# Altium schematic sheet HBridge.SchDoc: Sample Sheet Title
size B; Date: MM/DD/YYYY; Author: Sample Author; Organization: ORGANIZATION; Address1: ADDRESS 1; Address2: ADDRESS 2; Address3: ADDRESS 3; Address4: ADDRESS 4; Revision: -; SheetNumber: 1; SheetTotal: 3; ENG_APP_DATE: --/--/--; DSN_APP_DATE: --/--/--; CHK_APP_DATE: --/--/--
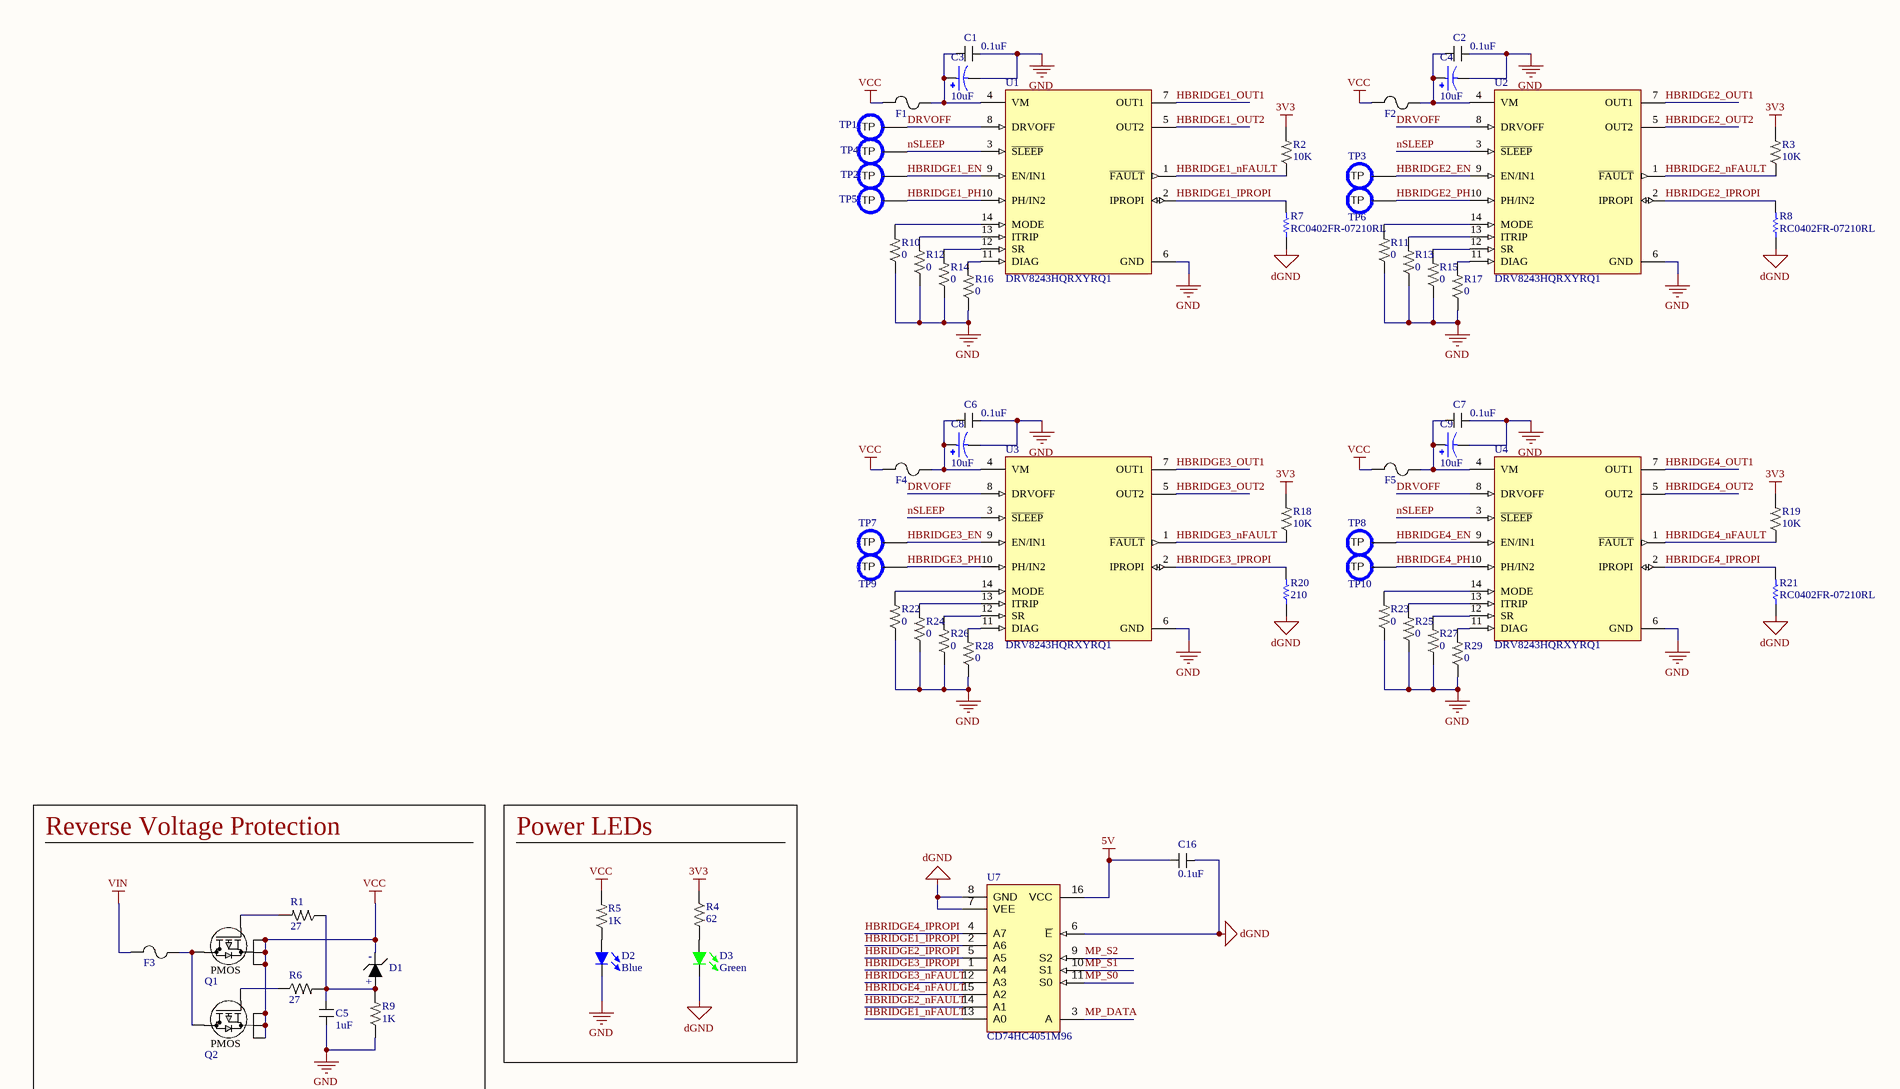
[diagram p0: HBridge.SchDoc, top left]
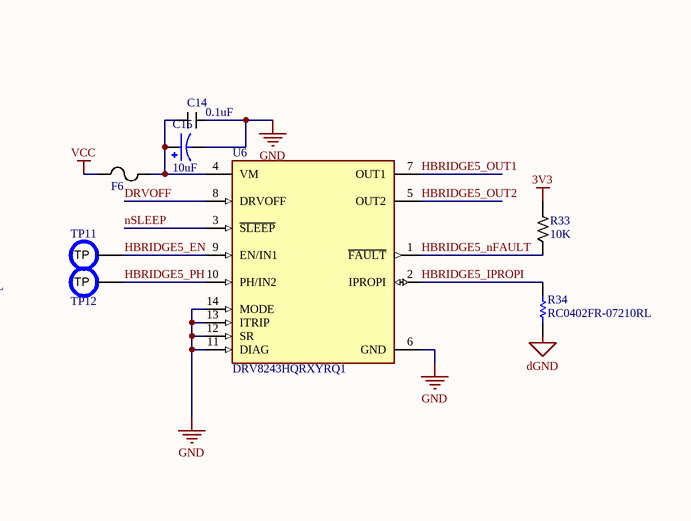
[diagram p1: HBridge.SchDoc, top right]
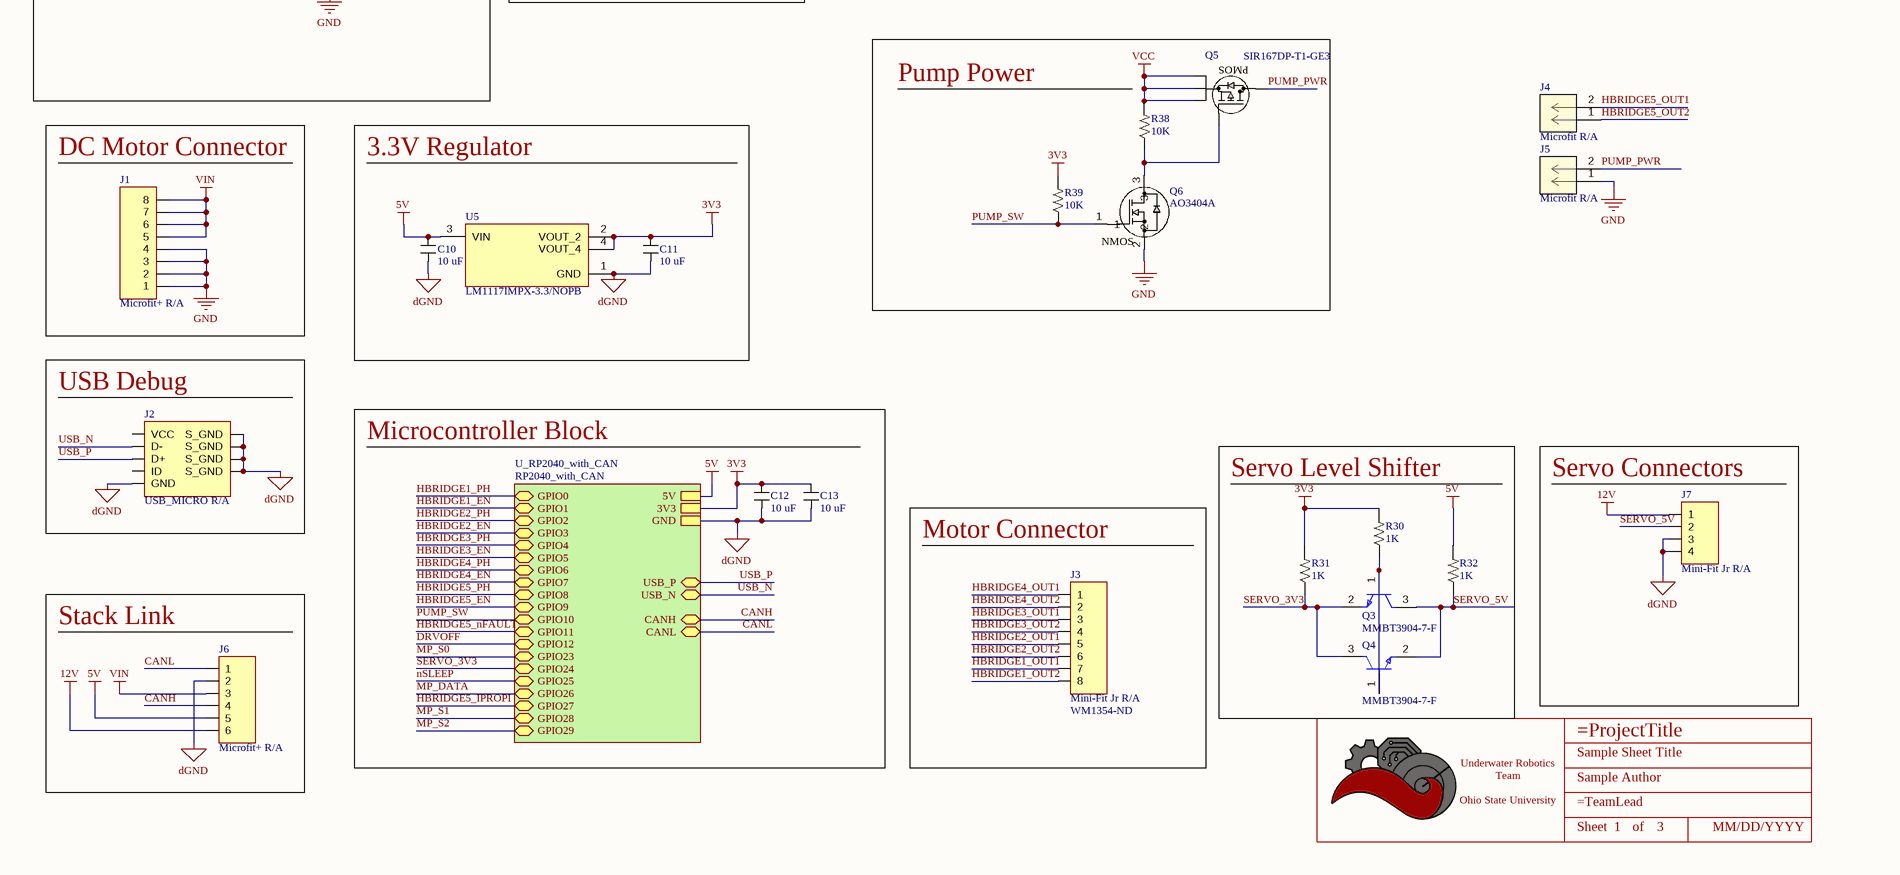
[diagram p2: HBridge.SchDoc, bottom left]

## Parts
*  Title_Block  [LOGO]  (value not drawn)  (graphical)
C1  value 0.1uF  [CAPACITOR_0805]  (hidden comment: 100nF Ceramic 50V)
C2  value 0.1uF  [CAPACITOR_0805]  (hidden comment: 100nF Ceramic 50V)
C3  value 10uF  [CAP_EEHZC1J100P]  (hidden comment: 10uF electrolytic 63V)
C4  value 10uF  [CAP_EEHZC1J100P]  (hidden comment: 10uF electrolytic 63V)
C5  value 1uF  [CAPACITOR_0603]  (hidden comment: 1uF Ceramic 16V)
C6  value 0.1uF  [CAPACITOR_0805]  (hidden comment: 100nF Ceramic 50V)
C7  value 0.1uF  [CAPACITOR_0805]  (hidden comment: 100nF Ceramic 50V)
C8  value 10uF  [CAP_EEHZC1J100P]  (hidden comment: 10uF electrolytic 63V)
C9  value 10uF  [CAP_EEHZC1J100P]  (hidden comment: 10uF electrolytic 63V)
C10  Value (uF): 10 uF  [CAPACITOR_0603]  (hidden comment: 10uF Ceramic 6.3V)
C11  Value (uF): 10 uF  [CAPACITOR_0603]  (hidden comment: 10uF Ceramic 6.3V)
C12  Value (uF): 10 uF  [CAPACITOR_0603]  (hidden comment: 10uF Ceramic 6.3V)
C13  Value (uF): 10 uF  [CAPACITOR_0603]  (hidden comment: 10uF Ceramic 6.3V)
C14  value 0.1uF  [CAPACITOR_0805]  (hidden comment: 100nF Ceramic 50V)
C15  value 10uF  [CAP_EEHZC1J100P]  (hidden comment: 10uF electrolytic 63V)
C16  value 0.1uF  [CAPACITOR_0402]  (hidden comment: 100nF Ceramic 25V)
D1  Zener_Diode_10V_410mW  [SOD-123]  (value not drawn)
D2  Color: Blue  [LED_0603]  (hidden comment: 150060BS75000)
D3  Color: Green  [LED_0603]  (hidden comment: 150060GS75000)
F1  0685H9150-01  [0501Series_LTF]  (value not drawn)
F2  0685H9150-01  [0501Series_LTF]  (value not drawn)
F3  1245HC60-RTR  [2-SMD Fuse]  (value not drawn)
F4  0685H9150-01  [0501Series_LTF]  (value not drawn)
F5  0685H9150-01  [0501Series_LTF]  (value not drawn)
F6  0685H9150-01  [0501Series_LTF]  (value not drawn)
J1  Microfit+ R/A  [CONN_MOLEX_MICROFIT+_8POS_R/A]
J2  USB_MICRO R/A  [CONN_MINIUSB]
J3  Mini-Fit Jr R/A  Supplier Part Number 1: WM1354-ND  [CONN_MOLEX_MINIFIT JR_8 POS_R/A]
J4  Microfit R/A  [CONN_MOLEX_MICROFIT_2 POS_R/A]
J5  Microfit R/A  [CONN_MOLEX_MICROFIT_2 POS_R/A]
J6  Microfit+ R/A  [CONN_MOLEX_MICROFIT_6_POS_R/A]
J7  Mini-Fit Jr R/A  [CONN_MOLEX_MINIFIT JR_4 POS_R/A]
Q1  MOSFET P-Ch 30V 60A SO-8  [MOSFET_7DP-T1-GE3_VIS]  (value not drawn)
Q2  MOSFET P-Ch 30V 60A SO-8  [MOSFET_7DP-T1-GE3_VIS]  (value not drawn)
Q3  MMBT3904-7-F  [FP-SOT23-IPC_A]
Q4  MMBT3904-7-F  [FP-SOT23-IPC_A]
Q5  SIR167DP-T1-GE3  [MOSFET_7DP-T1-GE3_VIS]
Q6  AO3404A  [SOT-23-3]
R1  Value  (Ohms): 27  [RESISTOR_0603]  (hidden comment: 27 Ohm 5% 1/8W)
R2  Value  (Ohms): 10K  [RESISTOR_0402]  (hidden comment: 10k Ohm 1% 1/16W)
R3  Value  (Ohms): 10K  [RESISTOR_0402]  (hidden comment: 10k Ohm 1% 1/16W)
R4  Value  (Ohms): 62  [RESISTOR_0603]  (hidden comment: 62 Ohm 1% 1/4W)
R5  Value  (Ohms): 1K  [RESISTOR_0603]  (hidden comment: 1k Ohm 5% 1/8W)
R6  Value  (Ohms): 27  [RESISTOR_0603]  (hidden comment: 27 Ohm 5% 1/8W)
R7  RC0402FR-07210RL  [RESC1005X40X25LL05T10]
R8  RC0402FR-07210RL  [RESC1005X40X25LL05T10]
R9  Value  (Ohms): 1K  [RESISTOR_0603]  (hidden comment: 1k Ohm 5% 1/8W)
R10  Value  (Ohms): 0  [RESISTOR_0402]  (hidden comment: 0 Ohm 1% 1/16W)
R11  Value  (Ohms): 0  [RESISTOR_0402]  (hidden comment: 0 Ohm 1% 1/16W)
R12  Value  (Ohms): 0  [RESISTOR_0402]  (hidden comment: 0 Ohm 1% 1/16W)
R13  Value  (Ohms): 0  [RESISTOR_0402]  (hidden comment: 0 Ohm 1% 1/16W)
R14  Value  (Ohms): 0  [RESISTOR_0402]  (hidden comment: 0 Ohm 1% 1/16W)
R15  Value  (Ohms): 0  [RESISTOR_0402]  (hidden comment: 0 Ohm 1% 1/16W)
R16  Value  (Ohms): 0  [RESISTOR_0402]  (hidden comment: 0 Ohm 1% 1/16W)
R17  Value  (Ohms): 0  [RESISTOR_0402]  (hidden comment: 0 Ohm 1% 1/16W)
R18  Value  (Ohms): 10K  [RESISTOR_0402]  (hidden comment: 10k Ohm 1% 1/16W)
R19  Value  (Ohms): 10K  [RESISTOR_0402]  (hidden comment: 10k Ohm 1% 1/16W)
R20  210  [RESC1005X40X25LL05T10]
R21  RC0402FR-07210RL  [RESC1005X40X25LL05T10]
R22  Value  (Ohms): 0  [RESISTOR_0402]  (hidden comment: 0 Ohm 1% 1/16W)
R23  Value  (Ohms): 0  [RESISTOR_0402]  (hidden comment: 0 Ohm 1% 1/16W)
R24  Value  (Ohms): 0  [RESISTOR_0402]  (hidden comment: 0 Ohm 1% 1/16W)
R25  Value  (Ohms): 0  [RESISTOR_0402]  (hidden comment: 0 Ohm 1% 1/16W)
R26  Value  (Ohms): 0  [RESISTOR_0402]  (hidden comment: 0 Ohm 1% 1/16W)
R27  Value  (Ohms): 0  [RESISTOR_0402]  (hidden comment: 0 Ohm 1% 1/16W)
R28  Value  (Ohms): 0  [RESISTOR_0402]  (hidden comment: 0 Ohm 1% 1/16W)
R29  Value  (Ohms): 0  [RESISTOR_0402]  (hidden comment: 0 Ohm 1% 1/16W)
R30  Value  (Ohms): 1K  [RESISTOR_0603]  (hidden comment: 1k Ohm 5% 1/8W)
R31  Value  (Ohms): 1K  [RESISTOR_0603]  (hidden comment: 1k Ohm 5% 1/8W)
R32  Value  (Ohms): 1K  [RESISTOR_0603]  (hidden comment: 1k Ohm 5% 1/8W)
R33  Value  (Ohms): 10K  [RESISTOR_0402]  (hidden comment: 10k Ohm 1% 1/16W)
R34  RC0402FR-07210RL  [RESC1005X40X25LL05T10]
R38  Value  (Ohms): 10K  [RESISTOR_0603]  (hidden comment: 10k Ohm 5% 1/10W)
R39  Value  (Ohms): 10K  [RESISTOR_0603]  (hidden comment: 10k Ohm 5% 1/10W)
TP1  PCB Test Point  [TESTPOINT_1.2MM]  (value not drawn)  (no BOM)
TP2  PCB Test Point  [TESTPOINT_1.2MM]  (value not drawn)  (no BOM)
TP3  PCB Test Point  [TESTPOINT_1.2MM]  (value not drawn)  (no BOM)
TP4  PCB Test Point  [TESTPOINT_1.2MM]  (value not drawn)  (no BOM)
TP5  PCB Test Point  [TESTPOINT_1.2MM]  (value not drawn)  (no BOM)
TP6  PCB Test Point  [TESTPOINT_1.2MM]  (value not drawn)  (no BOM)
TP7  PCB Test Point  [TESTPOINT_1.2MM]  (value not drawn)  (no BOM)
TP8  PCB Test Point  [TESTPOINT_1.2MM]  (value not drawn)  (no BOM)
TP9  PCB Test Point  [TESTPOINT_1.2MM]  (value not drawn)  (no BOM)
TP10  PCB Test Point  [TESTPOINT_1.2MM]  (value not drawn)  (no BOM)
TP11  PCB Test Point  [TESTPOINT_1.2MM]  (value not drawn)  (no BOM)
TP12  PCB Test Point  [TESTPOINT_1.2MM]  (value not drawn)  (no BOM)
U1  DRV8243HQRXYRQ1  [FP-RXY0014A-MFG]
U2  DRV8243HQRXYRQ1  [FP-RXY0014A-MFG]
U3  DRV8243HQRXYRQ1  [FP-RXY0014A-MFG]
U4  DRV8243HQRXYRQ1  [FP-RXY0014A-MFG]
U5  LM1117IMPX-3.3/NOPB  [SOT-223-4]
U6  DRV8243HQRXYRQ1  [FP-RXY0014A-MFG]
U7  CD74HC4051M96  [D0016A_M]

## Blocks framed on the sheet
Reverse Voltage Protection: C5 D1 F3 Q1 Q2 R1 R6 R9
Power LEDs: D2 D3 R4 R5
Pump Power: Q5 Q6 R38 R39
DC Motor Connector: J1
3.3V Regulator: C10 C11 U5
USB Debug: J2
Microcontroller Block: C12 C13
Servo Level Shifter: Q3 Q4 R30-R32
Servo Connectors: J7
Motor Connector: J3
Stack Link: J6

## Sub-sheets
U_RP2040_with_CAN = RP2040_with_CAN: USB_P (bidir), USB_N (bidir), 5V, CANH (bidir), CANL (bidir), GPIO0 (bidir), GPIO1 (bidir), GPIO2 (bidir), GPIO3 (bidir), GPIO4 (bidir), GPIO5 (bidir), GPIO6 (bidir), GPIO7 (bidir), GPIO8 (bidir), GPIO9 (bidir), GPIO10 (bidir), GPIO11 (bidir), GPIO12 (bidir), GPIO23 (bidir), GPIO24 (bidir), GPIO25 (bidir), GPIO26 (bidir), GPIO27 (bidir), GPIO28 (bidir), GPIO29 (bidir), 3V3, GND

## Nets
3V3: C11.1 C12.1 C13.1 R2.1 R3.1 R4.2 R18.1 R19.1 R30.1 R31.1 R33.1 R39.1 U5.2(VOUT_2) U5.4(VOUT_4) ; sheet U_RP2040_with_CAN/3V3
5V: C10.1 C16.2 J6.5 R32.1 U5.3(VIN) U7.16(VCC) ; sheet U_RP2040_with_CAN/5V
12V: J6.6 J7.1
dGND: C10.2 C11.2 C12.2 C13.2 C16.1 D3.2 J2.5(GND) J2.6(S_GND) J2.7(S_GND) J2.8(S_GND) J2.9(S_GND) J6.2 J7.3 J7.4 R7.1 R8.1 R20.1 R21.1 R34.1 U5.1(GND) U7.6(~{E}) U7.7(VEE) U7.8(GND) ; sheet U_RP2040_with_CAN/GND
GND: C1.1 C2.1 C3.2 C4.2 C5.1 C6.1 C7.1 C8.2 C9.2 C14.1 C15.2 D2.2 J1.1 J1.2 J1.3 J1.4 J5.1 Q6.2 R9.2 R10.2 R11.2 R12.2 R13.2 R14.2 R15.2 R16.2 R17.2 R22.2 R23.2 R24.2 R25.2 R26.2 R27.2 R28.2 R29.2 U1.6(GND) U2.6(GND) U3.6(GND) U4.6(GND) U6.6(GND) U6.11(DIAG) U6.12(SR) U6.13(ITRIP) U6.14(MODE)
VCC: D1.2 F1.1 F2.1 F4.1 F5.1 F6.1 Q1.1(S) Q1.2(S) Q1.3(S) Q2.1(S) Q2.2(S) Q2.3(S) Q5.1(S) Q5.2(S) Q5.3(S) R5.1 R38.1
VIN: F3.1 J1.5 J1.6 J1.7 J1.8 J6.3
CANH: J6.4 ; sheet U_RP2040_with_CAN/CANH
CANL: J6.1 ; sheet U_RP2040_with_CAN/CANL
DRVOFF: TP1.TP U1.8(DRVOFF) U2.8(DRVOFF) U3.8(DRVOFF) U4.8(DRVOFF) U6.8(DRVOFF) ; sheet U_RP2040_with_CAN/GPIO12
HBRIDGE1_EN: TP2.TP U1.9(EN/IN1) ; sheet U_RP2040_with_CAN/GPIO1
HBRIDGE1_IPROPI: R7.2 U1.2(IPROPI) U7.2(A6)
HBRIDGE1_nFAULT: R2.2 U1.1(~{FAULT}) U7.13(A0)
HBRIDGE1_OUT1: J3.7 U1.7(OUT1)
HBRIDGE1_OUT2: J3.8 U1.5(OUT2)
HBRIDGE1_PH: TP5.TP U1.10(PH/IN2) ; sheet U_RP2040_with_CAN/GPIO0
HBRIDGE2_EN: TP3.TP U2.9(EN/IN1) ; sheet U_RP2040_with_CAN/GPIO3
HBRIDGE2_IPROPI: R8.2 U2.2(IPROPI) U7.5(A5)
HBRIDGE2_nFAULT: R3.2 U2.1(~{FAULT}) U7.14(A1)
HBRIDGE2_OUT1: J3.5 U2.7(OUT1)
HBRIDGE2_OUT2: J3.6 U2.5(OUT2)
HBRIDGE2_PH: TP6.TP U2.10(PH/IN2) ; sheet U_RP2040_with_CAN/GPIO2
HBRIDGE3_EN: TP7.TP U3.9(EN/IN1) ; sheet U_RP2040_with_CAN/GPIO5
HBRIDGE3_IPROPI: R20.2 U3.2(IPROPI) U7.1(A4)
HBRIDGE3_nFAULT: R18.2 U3.1(~{FAULT}) U7.12(A3)
HBRIDGE3_OUT1: J3.3 U3.7(OUT1)
HBRIDGE3_OUT2: J3.4 U3.5(OUT2)
HBRIDGE3_PH: TP9.TP U3.10(PH/IN2) ; sheet U_RP2040_with_CAN/GPIO4
HBRIDGE4_EN: TP8.TP U4.9(EN/IN1) ; sheet U_RP2040_with_CAN/GPIO7
HBRIDGE4_IPROPI: R21.2 U4.2(IPROPI) U7.4(A7)
HBRIDGE4_nFAULT: R19.2 U4.1(~{FAULT}) U7.15(A2)
HBRIDGE4_OUT1: J3.1 U4.7(OUT1)
HBRIDGE4_OUT2: J3.2 U4.5(OUT2)
HBRIDGE4_PH: TP10.TP U4.10(PH/IN2) ; sheet U_RP2040_with_CAN/GPIO6
HBRIDGE5_EN: TP11.TP U6.9(EN/IN1) ; sheet U_RP2040_with_CAN/GPIO9
HBRIDGE5_IPROPI: R34.2 U6.2(IPROPI) ; sheet U_RP2040_with_CAN/GPIO27
HBRIDGE5_nFAULT: R33.2 U6.1(~{FAULT}) ; sheet U_RP2040_with_CAN/GPIO11
HBRIDGE5_OUT1: J4.2 U6.7(OUT1)
HBRIDGE5_OUT2: J4.1 U6.5(OUT2)
HBRIDGE5_PH: TP12.TP U6.10(PH/IN2) ; sheet U_RP2040_with_CAN/GPIO8
MP_DATA: U7.3(A) ; sheet U_RP2040_with_CAN/GPIO26
MP_S0: U7.11(S0) ; sheet U_RP2040_with_CAN/GPIO23
MP_S1: U7.10(S1) ; sheet U_RP2040_with_CAN/GPIO28
MP_S2: U7.9(S2) ; sheet U_RP2040_with_CAN/GPIO29
nSLEEP: TP4.TP U1.3(~{SLEEP}) U2.3(~{SLEEP}) U3.3(~{SLEEP}) U4.3(~{SLEEP}) U6.3(~{SLEEP}) ; sheet U_RP2040_with_CAN/GPIO25
PUMP_PWR: J5.2 Q5.D
PUMP_SW: Q6.1 R39.2 ; sheet U_RP2040_with_CAN/GPIO10
SERVO_3V3: Q3.2(E) Q4.3(C) R31.2 ; sheet U_RP2040_with_CAN/GPIO24
SERVO_5V: J7.2 Q3.3(C) Q4.2(E) R32.2
USB_N: J2.2(D-) ; sheet U_RP2040_with_CAN/USB_N
USB_P: J2.3(D+) ; sheet U_RP2040_with_CAN/USB_P
NetC1_2: C1.2 C3.1 F1.2 U1.4(VM)
NetC2_2: C2.2 C4.1 F2.2 U2.4(VM)
NetC5_2: C5.2 D1.1 R1.2 R6.1 R9.1
NetC6_2: C6.2 C8.1 F4.2 U3.4(VM)
NetC7_2: C7.2 C9.1 F5.2 U4.4(VM)
NetC14_2: C14.2 C15.1 F6.2 U6.4(VM)
NetD2_1: D2.1 R5.2
NetD3_1: D3.1 R4.1
NetF3_2: F3.2 Q1.D Q2.D
NetQ1_4: Q1.4(G) R1.1
NetQ2_4: Q2.4(G) R6.2
NetQ3_1: Q3.1(B) Q4.1(B) R30.2
NetQ5_4: Q5.4(G) Q6.3 R38.2
NetR10_1: R10.1 U1.14(MODE)
NetR11_1: R11.1 U2.14(MODE)
NetR12_1: R12.1 U1.13(ITRIP)
NetR13_1: R13.1 U2.13(ITRIP)
NetR14_1: R14.1 U1.12(SR)
NetR15_1: R15.1 U2.12(SR)
NetR16_1: R16.1 U1.11(DIAG)
NetR17_1: R17.1 U2.11(DIAG)
NetR22_1: R22.1 U3.14(MODE)
NetR23_1: R23.1 U4.14(MODE)
NetR24_1: R24.1 U3.13(ITRIP)
NetR25_1: R25.1 U4.13(ITRIP)
NetR26_1: R26.1 U3.12(SR)
NetR27_1: R27.1 U4.12(SR)
NetR28_1: R28.1 U3.11(DIAG)
NetR29_1: R29.1 U4.11(DIAG)

Not connected (* = marked no-connect by the designer): J2 1(VCC) 4(ID)

## Notes on the sheet
- DWG. NO.
- REV.
- SHT.
- THIS DOCUMENT AND THE DATA DISCLOSED HEREIN OR HEREWITH IS THE PROPERTY OF ALTIUM LIMITED AND MAY BE FREELY DISTRIBUTED IN WHOLE. NO RIGHTS ARE RESERVED OR EXPRESS OR IMPLIED WARANTEE GIVEN.
- REVISION
- DESCRIPTION
- DATE
- APPROVED
- ENG:
- APPROVALS
- PROJECT
- DSN:
- CHK:
- REFERENCE DOCUMENTS
- PROJECT REVISION:
- TITLE
- DOCUMENT REVISION:
- DESIGN ITEM:
- BOM:
- FAB DWG:
- PCB DWG:
- ASSY DWG:
- SCALE:
- SIZE
- B
- CAGE CODE
- FILE NAME
- DWG NO.
- SHEET
- OF
- REV
- (in symbol AO3404A) NMOS
- (in symbol SIR167DP-T1-GE3) PMOS
- (in symbol Title_Block) Underwater Robotics Team / Ohio State University; Sheet; of
- (in symbol Zener_Diode_10V_410mW) -; +

## Library data of the parts
* = Title_Block: UWRT Schematic Title Block Template / Created June 2021, Dylan Trainor
C1 C2 C6 C7 C14 = CAPACITOR_0.1uF_0805: Cap 100nF 50V +/-10% / Ceramic 0805; Made By: Robert Pafford; Tolerance: +/- 10%; Voltage: 50V; Supplier 1: Newark; Supplier Part Number 1: 38AH3645
C3 C4 C8 C9 C15 = CAP ALUM 10UF 20% 63V SMD: 10 µF 63 V Aluminum - Polymer Capacitors Radial, Can SMD 120mOhm; Made by: Robert Pafford; Tolerance: +/- 20%; Max Voltage: 63V; Supplier 1: Digi-Key; Supplier Part Number 1: P15466CT-ND
C5 = CAPACITOR_1uF_0603: Cap 1uF 16V +/-10% / Ceramic 0603; Made By: Flip B; Tolerance: +/- 10%; Voltage: 16V; Supplier 1: Arrow Electronics; Supplier Part Number 1: C1608X7R1C105K080AC
C10-C13 = CAPACITOR_10uF_0603: Cap 10uF 6.3V +/-20% / Ceramic 0603; Made By: Flip B; ComponentLink1Description: Digikey; ComponentLink1URL: https://www.digikey.com/en/products/detail/samsung-electro-mechanics/CL10A106MQ8NNNC/3886777; Supplier 1: Digi-Key; Supplier Part Number 1: 1276-1119-1-ND; Tolerance: +/- 20%; Voltage: 6.3V
C16 = CAPACITOR_0.1uF_0402: Cap 100nF 25V +/-10% / Ceramic 0402; Made By: Robert Pafford; Tolerance: +/- 10%; Voltage: 25V; Supplier 1: Future Electronics; Supplier Part Number 1: 7029569
D1 = Zener_Diode_10V_410mW: Zener Diode | 10 V | 410 mW | SOD 123; Made By: Nathan A; Voltage - Zener: 10V; Power: 410mW; Package: SOD-123; Supplier 1: Digi-Key; Supplier Part Number 1: 3757-BZT52-C10_R1_00001CT-ND; ComponentLink1Description: Datasheet; ComponentLink1URL: https://www.panjit.com.tw/upload/datasheet/BZT52-C2V4_SERIES.pdf
D2 = LED_Blue_0603: LED Blue Vf= 3.2V If = 0.020A / 150060BS75000; Made By: Robert Pafford; Forward Current: 20mA; Forward Voltage: 3.2V; Package: 0603; Supplier 1: Digi-Key; Supplier Part Number 1: 732-4966-1-ND
D3 = LED_Green_0603_3.2V: LED Green Vf= 3.2V If = 0.025A / 150060GS75000; Made By: Flip B; Forward Current: 25mA; Supplier 1: Digi-Key; ComponentLink1Description: Datasheet; ComponentLink1URL: https://www.we-online.de/katalog/datasheet/150060GS75000.pdf; Supplier Part Number 1: 732-4971-1-ND; Forward Voltage: 3.2V; Package: 0603
F1 F2 F4-F6 = Bel Fuse 15A: Bel Fuse  | 15A | 32V DC | SMD | Fast Blow | 1206; Current Rating: 15; Breaking Capacity: 150A; Mfr_Name: Bel Fuse; Manufacturer_Part_Number: 0685H9150-01; Voltage Rating: 32V; Response Time: Fast Blow; Package: 1206; Created By: Nathan Ayer
F3 = Eaton 60A Fuse: Eaton  | 60A | 80V DC | SMD | Fast Blow | 2-SMD; Breaking Capacity: 1kA; Mfr_Name: Eaton; Manufacturer_Part_Number: 1245HC60-RTR; Current Rating: 60A; Voltage Rating: 80V; Response Time: Fast Blow; Package: 2-SMD; Created By: Nathan Ayer; ComponentLink1Description: DigiKey; ComponentLink1URL: https://www.digikey.com/en/products/detail/eaton-electronics-division/1245HC60-RTR/13913536
J1 = CONN_MOLEX_MICROFIT+_8POS_R/A: Molex Microfit+ / 212528 8 POS R/A Black; Current Rating: 12.5A; Pitch: 3.0mm; Supplier 1: Digikey; Supplier Part Number 1: 900-2125280800-ND; Manufacturer: Molex; Configuration: R/A; Color: Black
J2 = CONN_MICROUSB: Amphenol Micro USB-B / USB2.0 5 Pin Right Angle SMD; Pitch: 0.65mm; Current Per Pin: 1.8A; Number of Positions: 5; Manufacturer: Amphenol; Configuration: Right Angle; Color: Silver; Created By: Flip B; ComponentLink1Description: Datasheet; ComponentLink1URL: https://cdn.amphenol-icc.com/media/wysiwyg/files/documentation/datasheet/inputoutput/io_usb_micro.pdf?__cf_chl_jschl_tk__=05693735e19256298f6ef6ca2bb2e65c376a4f56-1625503833-0-Abitsb0-ufjOXJYs_S3J3r2iTn-nObalbmXUksF1VvO_h_WEmRdMlUD1I8-hmWSEVWzY1pirKnrPZWfgY3851qyBZe5ZvnNQePLGIzUgdEIQBVUyW36RsbYpDLEWxJ4horD-5gChFgobLYqwmG5aHl0E8lIn_twwPPrOxilK2gP0q9t_CNOs_u5fMqXvXUrlsOv8tIE2NRlu6NVP8qtkL2GjhlkeTUbDMF8WvvpPDTFOgvZ4Y16Ej8F8AhWos88mo5B1HssXozw0XrkJQIqERITUu6rqloz9kf4ZzhBHtDAt-IkiAFY_Ds9SW8FYKKTtINJVpHZQ6Gyu1FFM4Dc9MO0maE8_mmNcwlxqyRoRk_MPWW8VyByXWM5RSp52jteRKw7FeI9WIYvCbPAOy0Eyib-aseIQsnGbglBcUY6_2xp8GYaJM38H3dNvBPsSOfJBPndKedwKHllxjkucXn6xsN0sDXkpGN-cu8_2bDTJ0g-uUucKSCooYX-ApSDNGpkA_p9zv1SOAD8c0zaZVmtiBsN75QpVz2rzq9_BFxOywPvR; Series: 10118192; Supplier 1: Digi-Key; Supplier Part Number 1: 609-4613-1-ND
J3 = CONN_MOLEX_MINIFIT JR_8POS_R/A: Molex Minifit Jr. 5569 / 8 Pos R/A Natural; Pitch: 4.2mm; Configuration: Right Angle; Current Per Pin: 13A; Number of Positions: 8; Manufacturer: Molex; Color: Natural; Created By: Flip B; ComponentLink1Description: Datasheet; ComponentLink1URL: https://www.molex.com/pdm_docs/ps/PS-5556-001.pdf; Series: Minifit Jr 5569; Supplier 1: Digi-Key
J4 J5 = CONN_MOLEX_MICROFIT_2 POS_R/A: CONN HEADER R/A 2POS; Manufacturer: Molex; Pitch: 3mm; Current Rating: 8A; Supplier 1: Digikey; Supplier Part Number 1: WM1813-ND; Configuration: R/A; Color: Black
J6 = CONN_MOLEX_MICROFIT+_6POS_R/A: Molex Microfit+ / 212528 6 POS R/A Black; Pitch: 3.0mm; Current Per Pin: 12.5; Supplier 1: Digikey; Supplier Part Number 1: 900-2125280600-ND; Manufacturer: Molex; Configuration: R/A; Color: Black
J7 = CONN_MOLEX_MINIFIT JR_4POS_R/A: Molex Minifit Jr. 5569 / 4 Pos R/A Natural; Pitch: 4.2mm; Configuration: Right Angle; Current Per Pin: 13A; Number of Positions: 4; Supplier Part Number 1: WM13112-ND; Supplier 1: Digi-Key; Manufacturer: Molex; Color: Natural; Created By: Flip B; ComponentLink1Description: Datasheet; ComponentLink1URL: https://www.molex.com/pdm_docs/sd/026013115_sd.pdf; Series: Minifit Jr 5569
Q1 Q2 Q5 = SIR167DP-T1-GE3: P-Channel 30 V 60A (Tc) 65.8W (Tc) Surface Mount PowerPAK® SO-8; Mfr_Name: Vishay; Type: DEV; Copyright: Copyright (C) 2022 Ultra Librarian. All rights reserved.; Manufacturer_Part_Number: SIR167DP-T1-GE3; RefDes: RefDes; Supplier 1: Mouser; Supplier Part Number 1: 78-SIR167DP-T1-GE3
Q3 Q4 = CMP-2000-04931-2: TRANS NPN 40V 0.2A SMD SOT23-3; Frequency: 300MHz; Power Dissipation: 350mW; Element Configuration: Single; Max Power Dissipation: 300mW; Max Collector Current: 200mA; Collector Emitter Saturation Voltage: 300mV; Number of Elements: 1; hFE Min: 100; Collector Base Voltage (VCBO): 60V; Emitter Base Voltage (VEBO): 6V; Contact Plating: Tin; Package Quantity: 3000; Max Frequency: 300MHz; REACH SVHC: No SVHC; Max Operating Temperature: 150°C; Width: 1.4mm; Collector Emitter Voltage (VCEO): 40V; Voltage Rating (DC): 40V; Radiation Hardening: No; Case/Package: SOT-23; Height: 1mm; Collector Emitter Breakdown Voltage: 40V; Length: 3.05mm; Polarity: NPN; Packaging: Tape and Reel; Number of Pins: 3; Min Operating Temperature: -55°C; Gain Bandwidth Product: 300MHz; Mount: Surface Mount; Weight: 0.000282oz; Continuous Collector Current: 200mA; Transition Frequency: 300MHz; Max Breakdown Voltage: 40V; Lead Free: Lead Free
Q6 = AO3404A: N-Channel 30 V 5.8A (Ta) 1.4W (Ta) Surface Mount SOT-23-3; Vendor: Alpha & Omega Semiconductor Inc.; SourceLibrary: ON_Semiconductor_2020-01-13; Vgs (Max): 3V @ 5.8A, 10V; Vgs (th): 3V @ 250µA; Vdss: 30V; Rds (on): 28mOhm @ 5.8A, 10V; Amp Rating: 5.8 A; FET Type: N-Channel; Package: SOT23-3L; Manufacturer _Part_Number: AO3404A; Power Dissipation: 1.4W (Ta); Supplier 1: Digi-Key; Supplier Part Number 1: 785-1004-1-ND; Created By: Dylan T
R1 R6 = RESISTOR_27_0603: RES 27 OHM 5% 1/8W 0603; Tolerance: +/- 5%; Made By: Robert Pafford; ComponentLink1Description: Datasheet; ComponentLink1URL: https://www.bourns.com/docs/product-datasheets/CRxxxxx.pdf; Wattage: 1/8W; Supplier: Digikey; Digikey Part Numer: CR0603-JW-104ELFTR-ND; Supplier 1: Digi-Key; Supplier Part Number 1: 2019-RK73B1JTTD270JCT-ND
R2 R3 R18 R19 R33 = RESISTOR_10K_0402: RES 10k OHM 1% 1/16W 0402; Tolerance: +/- 1%; Made By: Robert Pafford; Wattage: 1/16W; Supplier: Digikey; Digikey Part Numer: CR0603-JW-104ELFTR-ND; Supplier 1: Digi-Key; Supplier Part Number 1: YAG3436CT-ND
R4 = RESISTOR_62_0603: RES SMD 62 OHM 1% 1/4W 0603; Tolerance: +/- 1%; Made By: Robert Pafford; ComponentLink1Description: Datasheet; ComponentLink1URL: https://www.bourns.com/docs/product-datasheets/CRxxxxx.pdf; Wattage: 1/4W; Supplier: Digikey; Digikey Part Numer: CR0603-JW-104ELFTR-ND; Supplier 1: Digi-Key; Supplier Part Number 1: 541-RCS060362R0FKEACT-ND
R5 R9 R30-R32 = RESISTOR_1K_0603: RES 1k OHM 5% 1/8W 0603; Tolerance: +/- 5%; Made By: Robert Pafford; ComponentLink1Description: Datasheet; ComponentLink1URL: https://www.bourns.com/docs/product-datasheets/CRxxxxx.pdf; Wattage: 1/8W; Supplier: Digikey; Digikey Part Numer: CR0603-JW-104ELFTR-ND; Supplier 1: Digi-Key; Supplier Part Number 1: 2019-RK73B1JTTD102JCT-ND
R7 R8 R21 R34 = CMP-2002-07503-1: Manufacturer: Yageo; Part Number: RC0402FR-07210RL
R10-R17 R22-R29 = RESISTOR_0_0402: RES 0 OHM 1% 1/16W 0402; Tolerance: +/- 1%; Made By: Robert Pafford; Wattage: 1/16W; Supplier 1: Digikey; Supplier Part Number 1: 13-AC0402FR-070RLCT-ND
R20 = CMP-2002-07503-1: Part Number: RC0402FR-07210RL; Manufacturer: Yageo
R38 R39 = RESISTOR_10K_0603: RES 10k OHM 5% 1/10W 0603; Tolerance: +/- 5%; Wattage: 1/8W; Made By: Robert Pafford; ComponentLink1Description: Datasheet; ComponentLink1URL: https://www.bourns.com/docs/product-datasheets/CRxxxxx.pdf; Supplier: Digikey; Digikey Part Numer: CR0603-JW-104ELFTR-ND; Supplier 1: Digi-Key; Supplier Part Number 1: 2019-RK73B1JTTD103JCT-ND
TP1-TP12 = TESTPOINT: Made By: Robert Pafford
U1-U4 U6 = DRV8243HQRXYRQ1: Automotive 40-V, 12-A H-Bridge driver with integrated current sensing and feedback 14-VQFN-HR -40 to 125
U5 = LM1117IMPX-3.3/NOPB: 800-mA 15-V linear voltage regulator 4-SOT-223 -40 to 125; MF: Texas Instruments; Texas_Instruments-Purchase-URL: https://snapeda.com/shop?store=Texas+Instruments&id=410186; Price: None; Mouser-Purchase-URL: https://snapeda.com/shop?store=Mouser&id=410186; MP: LM1117IMPX-3.3/NOPB; Value: *; Availability: Good; Package: SOT-223-4 Texas Instruments; Arrow_Electronics-Purchase-URL: https://snapeda.com/shop?store=Arrow+Electronics&id=410186; SnapEDA_Link: https://www.snapeda.com/parts/LM1117IMPX-3.3/NOPB/Texas%20Instruments/view-part/410186/?ref=snap; DigiKey-Purchase-URL: https://snapeda.com/shop?store=DigiKey&id=410186
U7 = CMP-1575-00036-4: High Speed CMOS 8-Channel Analog Multiplexer/Demultiplexer, D0016A, LARGE T&R; Manufacturer: Texas Instruments; Crosstalk: Yes; Ron(Max)(Ohms): 130; VCC(Min)(V): 2; Bandwidth(Max)(MHz): 180; VCC(Max)(V): 6; Rating: Catalog; Configuration: 1 X 1：8 MUX; Ron(Typ)(Ohms): 45; Generic Part Number: CD74HC4051; Output Type: CMOS; Operating Temperature Range(C): -55 to 125; DatasheetVersion: SCHS122J; Code_JEDEC: MS-012 variation AC; PackageReference: D0016A; PackageVersion: http://www.ti.com/lit/ml/mpds178g/mpds178g.pdf